# EAGLE design DA (EAGLE 9.4.2)
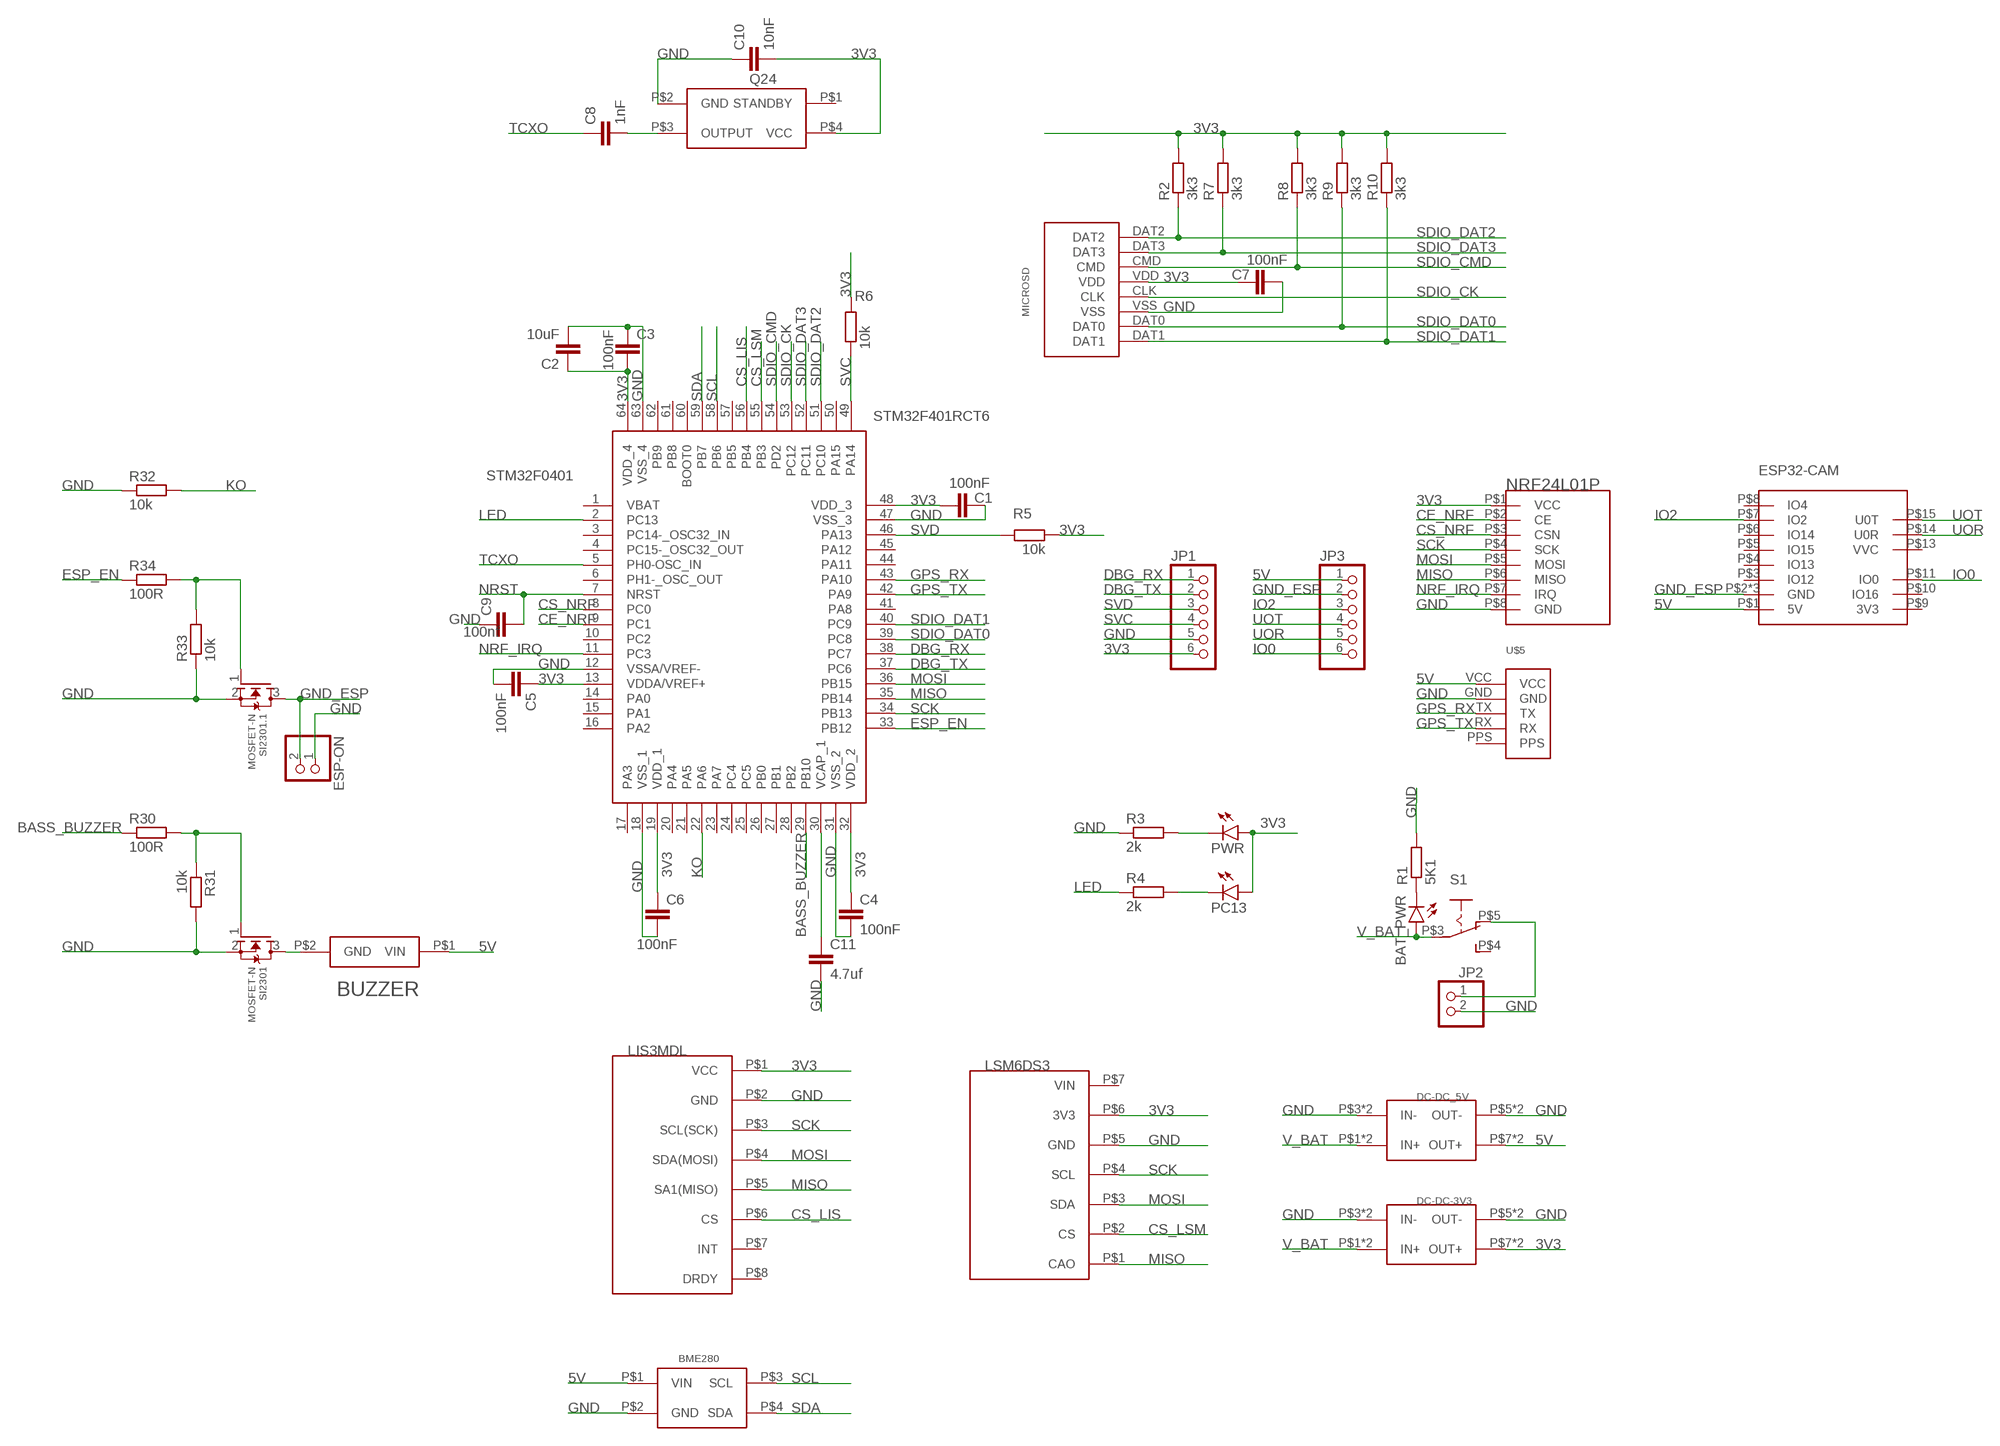
[diagram p0: schematic, sheet 1]

## Parts
BAT_PWR  LEDSML0603  [SML0603]
BME280  BME280BME280-PINS-ONLY  [BME280-PINS-ONLY]
BUZZER  BUZZERS8R6  [BUZZER-S8R12]
C1  100nF  C-EUC0603  [C0603]
C2  10uF  C-EUC1206  [C1206]
C3  100nF  C-EUC0603  [C0603]
C4  100nF  C-EUC0603  [C0603]
C5  100nF  C-EUC0603  [C0603]
C6  100nF  C-EUC0603  [C0603]
C7  100nF  C-EUC0603  [C0603]
C8  1nF  C-EUC0603  [C0603]
C9  100nf  C-EUC0603  [C0603]
C10  10nF  C-EUC0603  [C0603]
C11  4.7uf  C-EUC0603  [C0603]
DC-DC-3V3  MP1584-B  [MP1584-B]
DC-DC_5V  MP1584-B  [MP1584-B]
ESP32-CAM  ESP32-CAM  [ESP32-CAM]
ESP-ON  PINHD-1X2  [1X02]
JP1  PINHD-1X6  [1X06]
JP2  PINHD-1X2  [1X02]
JP3  PINHD-1X6  [1X06]
LIS3MDL  LIS3MDL-CJMCUбез_отв.  [LIS3MDL-CGMSU-NB2023-1]
LSM6DS3  LSM6DS3-GY-NB2023Без_отв.  [LSM6DS3-GY-NB2023-1]
MICROSD  SD  [SD]
NRF24L01P  NRF24L01_ML01SP4  [NRF24L01_ML01SP4]
PC13  LEDCHIPLED_0603  [CHIPLED_0603]
PWR  LEDCHIPLED_0603  [CHIPLED_0603]
Q24  Q24  [Q24]
R1  5K1  R-EU_R0603  [R0603]
R2  3k3  R-EU_R0603  [R0603]
R3  2k  R-EU_R0603  [R0603]
R4  2k  R-EU_R0603  [R0603]
R5  10k  R-EU_R0603  [R0603]
R6  10k  R-EU_R0603  [R0603]
R7  3k3  R-EU_R0603  [R0603]
R8  3k3  R-EU_R0603  [R0603]
R9  3k3  R-EU_R0603  [R0603]
R10  3k3  R-EU_R0603  [R0603]
R30  100R  R-EU_R0603  [R0603]
R31  10k  R-EU_R0603  [R0603]
R32  10k  R-EU_R0603  [R0603]
R33  10k  R-EU_R0603  [R0603]
R34  100R  R-EU_R0603  [R0603]
S1  UNICS-SWITCH  [SWITCH_SK-12F14]
SI2301  MOSFET-N  [SOT23-3]
SI2301.1  MOSFET-N  [SOT23-3]
STM32F0401  STM32F401RCT6  [QFP50P1200X1200X160-64N]
U$5  GPS_NEO7M_W-PPS  [GPS_NEO7M_W-PPS_&_ANT]

## Nets
3V3: C1.2 C2.1 C3.2 C4.1 C5.1 C6.1 C7.2 C10.2 DC-DC-3V3.P$7(OUT+) DC-DC-3V3.P$8(OUT+) JP1.6 LIS3MDL.P$1(VCC) LSM6DS3.P$6(3V3) MICROSD.VDD NRF24L01P.P$1(VCC) PC13.A PWR.A Q24.P$4(VCC) R2.2 R5.2 R6.2 R7.2 R8.2 R9.2 R10.2 STM32F0401.13(VDDA/VREF+) STM32F0401.19(VDD_1) STM32F0401.32(VDD_2) STM32F0401.48(VDD_3) STM32F0401.64(VDD_4)
5V: BME280.P$1(VIN) BUZZER.P$1(VIN) DC-DC_5V.P$7(OUT+) DC-DC_5V.P$8(OUT+) ESP32-CAM.P$1(5V) JP3.1 U$5.VCC
BASS_BUZZER: R30.1 STM32F0401.29(PB10)
CE_NRF: NRF24L01P.P$2(CE) STM32F0401.9(PC1)
CS_LIS: LIS3MDL.P$6(CS) STM32F0401.56(PB4)
CS_LSM: LSM6DS3.P$2(CS) STM32F0401.55(PB3)
CS_NRF: NRF24L01P.P$3(CSN) STM32F0401.8(PC0)
DBG_RX: JP1.1 STM32F0401.38(PC7)
DBG_TX: JP1.2 STM32F0401.37(PC6)
ESP_EN: R34.1 STM32F0401.33(PB12)
GND: BME280.P$2(GND) C1.1 C2.2 C3.1 C4.2 C5.2 C6.2 C7.1 C9.1 C10.1 C11.2 DC-DC-3V3.P$3(IN-) DC-DC-3V3.P$4(IN-) DC-DC-3V3.P$5(OUT-) DC-DC-3V3.P$6(OUT-) DC-DC_5V.P$3(IN-) DC-DC_5V.P$4(IN-) DC-DC_5V.P$5(OUT-) DC-DC_5V.P$6(OUT-) ESP-ON.1 JP1.5 JP2.2 LIS3MDL.P$2(GND) LSM6DS3.P$5(GND) MICROSD.VSS NRF24L01P.P$8(GND) Q24.P$2(GND) R1.2 R3.1 R31.2 R32.1 R33.1 SI2301.1.2(S) SI2301.2(S) STM32F0401.12(VSSA/VREF-) STM32F0401.18(VSS_1) STM32F0401.31(VSS_2) STM32F0401.47(VSS_3) STM32F0401.63(VSS_4) U$5.GND
GND_ESP: ESP32-CAM.P$2(GND) ESP32-CAM.P$12(GND) ESP32-CAM.P$16(GND) ESP-ON.2 JP3.2 SI2301.1.3(D)
GPS_RX: STM32F0401.43(PA10) U$5.TX
GPS_TX: STM32F0401.42(PA9) U$5.RX
IO0: ESP32-CAM.P$11(IO0) JP3.6
IO2: ESP32-CAM.P$7(IO2) JP3.3
KO: R32.2 STM32F0401.22(PA6)
LED: R4.1 STM32F0401.2(PC13)
MISO: LIS3MDL.P$5(SA1(MISO)) LSM6DS3.P$1(CAO) NRF24L01P.P$6(MISO) STM32F0401.35(PB14)
MOSI: LIS3MDL.P$4(SDA(MOSI)) LSM6DS3.P$3(SDA) NRF24L01P.P$5(MOSI) STM32F0401.36(PB15)
N$1: R30.2 R31.1 SI2301.1(G)
N$4: R33.2 R34.2 SI2301.1.1(G)
N$5: BAT_PWR.C R1.1
N$6: JP2.1 S1.P$5(O)
N$10: C8.2 Q24.P$3(OUTPUT)
N$12: C11.1 STM32F0401.30(VCAP_1)
N$20: BUZZER.P$2(GND) SI2301.3(D)
N$36: PWR.C R3.2
N$37: PC13.C R4.2
NRF_IRQ: NRF24L01P.P$7(IRQ) STM32F0401.11(PC3)
NRST: C9.2 STM32F0401.7(NRST)
SCK: LIS3MDL.P$3(SCL(SCK)) LSM6DS3.P$4(SCL) NRF24L01P.P$4(SCK) STM32F0401.34(PB13)
SCL: BME280.P$3(SCL) STM32F0401.58(PB6)
SDA: BME280.P$4(SDA) STM32F0401.59(PB7)
SDIO_CK: MICROSD.CLK STM32F0401.53(PC12)
SDIO_CMD: MICROSD.CMD R8.1 STM32F0401.54(PD2)
SDIO_DAT0: MICROSD.DAT0 R9.1 STM32F0401.39(PC8)
SDIO_DAT1: MICROSD.DAT1 R10.1 STM32F0401.40(PC9)
SDIO_DAT2: MICROSD.DAT2 R2.1 STM32F0401.51(PC10)
SDIO_DAT3: MICROSD.DAT3 R7.1 STM32F0401.52(PC11)
SVC: JP1.4 R6.1 STM32F0401.49(PA14)
SVD: JP1.3 R5.1 STM32F0401.46(PA13)
TCXO: C8.1 STM32F0401.5(PH0-OSC_IN)
UOR: ESP32-CAM.P$14(U0R) JP3.5
UOT: ESP32-CAM.P$15(U0T) JP3.4
V_BAT: BAT_PWR.A DC-DC-3V3.P$1(IN+) DC-DC-3V3.P$2(IN+) DC-DC_5V.P$1(IN+) DC-DC_5V.P$2(IN+) S1.P$3(P)
Unconnected: ESP32-CAM.P$3(IO12) ESP32-CAM.P$4(IO13) ESP32-CAM.P$5(IO15) ESP32-CAM.P$6(IO14) ESP32-CAM.P$8(IO4) ESP32-CAM.P$9(3V3) ESP32-CAM.P$10(IO16) ESP32-CAM.P$13(VVC) LIS3MDL.P$7(INT) LIS3MDL.P$8(DRDY) LSM6DS3.P$7(VIN) Q24.P$1(STANDBY) S1.P$4(S) STM32F0401.1(VBAT) STM32F0401.3(PC14-_OSC32_IN) STM32F0401.4(PC15-_OSC32_OUT) STM32F0401.6(PH1-_OSC_OUT) STM32F0401.10(PC2) STM32F0401.14(PA0) STM32F0401.15(PA1) STM32F0401.16(PA2) STM32F0401.17(PA3) STM32F0401.20(PA4) STM32F0401.21(PA5) STM32F0401.23(PA7) STM32F0401.24(PC4) STM32F0401.25(PC5) STM32F0401.26(PB0) STM32F0401.27(PB1) STM32F0401.28(PB2) STM32F0401.41(PA8) STM32F0401.44(PA11) STM32F0401.45(PA12) STM32F0401.50(PA15) STM32F0401.57(PB5) STM32F0401.60(BOOT0) STM32F0401.61(PB8) STM32F0401.62(PB9) U$5.PPS

## Library data of the parts
BAT_PWR PC13 PWR = led:LED: LED OSRAM: - CHIPLED LG R971, LG N971, LY N971, LG Q971, LY Q971, LO R971, LY R971 LH N974, LH R974 LS Q976, LO Q976, LY Q976 LO Q996 - Hyper CHIPLED LW Q18S LB Q993, LB Q99A, LB R99A - SideLED LS A670, LO A670, LY A670, LG A670, LP A670 LB A673, LV A673, LT A673, LW A673 LH A674 LY A675 LS A676, LA A676, LO A676, LY A676, LW A676 LS A679, LY A679, LG A679 - Hyper Micro SIDELED® LS Y876, LA Y876, LO Y876, LY Y876 LT Y87S - SmartLED LW L88C, LW L88S LB L89C, LB L89S, LG L890 LS L89K, LO L89K, LY L89K LS L896, LA L896, LO L896, LY L896 - TOPLED LS T670, LO T670, LY T670, LG T670, LP T670 LSG T670, LSP T670, LSY T670, LOP T670, LYG T670 LG T671, LOG T671, LSG T671 LB T673, LV T673, LT T673, LW T673 LH T674 LS T676, LA T676, LO T676, LY T676, LB T676, LH T676, LSB T676, LW T676 LB T67C, LV T67C, LT T67C, LS T67K, LO T67K, LY T67K, LW E67C LS E67B, LA E67B, LO E67B, LY E67B, LB E67C, LV E67C, LT E67C LW T67C LS T679, LY T679, LG T679 LS T770, LO T770, LY T770, LG T770, LP T770 LB T773, LV T773, LT T773, LW T773 LH T774 LS E675, LA E675, LY E675, LS T675 LS T776, LA T776, LO T776, LY T776, LB T776 LHGB T686 LT T68C, LB T68C - Hyper Mini TOPLED® LB M676 - Mini TOPLED Santana® LG M470 LS M47K, LO M47K, LY M47K Source: http://www.osram.convergy.de LUXEON: - LUMILED® LXK2-PW12-R00, LXK2-PW12-S00, LXK2-PW14-U00, LXK2-PW14-V00 LXK2-PM12-R00, LXK2-PM12-S00, LXK2-PM14-U00 LXK2-PE12-Q00, LXK2-PE12-R00, LXK2-PE12-S00, LXK2-PE14-T00, LXK2-PE14-U00 LXK2-PB12-K00, LXK2-PB12-L00, LXK2-PB12-M00, LXK2-PB14-N00, LXK2-PB14-P00, LXK2-PB14-Q00 LXK2-PR12-L00, LXK2-PR12-M00, LXK2-PR14-Q00, LXK2-PR14-R00 LXK2-PD12-Q00, LXK2-PD12-R00, LXK2-PD12-S00 LXK2-PH12-R00, LXK2-PH12-S00 LXK2-PL12-P00, LXK2-PL12-Q00, LXK2-PL12-R00 Source: www.luxeon.com KINGBRIGHT: KA-3528ASYC Source: www.kingbright.com
BME280 = NEON-BLADE-2023:BME280
BUZZER = NEON-BLADE-2023:BUZZER
C1-C11 = rcl:C-EU: CAPACITOR, European symbol; SPICEPREFIX: C
DC-DC-3V3 DC-DC_5V = NEON-BLADE-2023:MP1584-B
ESP32-CAM = NEON-BLADE-2023:ESP32-CAM
ESP-ON JP2 = pinhead:PINHD-1X2: PIN HEADER
JP1 JP3 = pinhead:PINHD-1X6: PIN HEADER
LIS3MDL = NEON-BLADE-2023:LIS3MDL-CJMCU
LSM6DS3 = NEON-BLADE-2023:LSM6DS3-GY-NB2023
MICROSD = NEON-BLADE-2023:SD
NRF24L01P = NEON-BLADE-2023:NRF24L01_ML01SP4
Q24 = CanCubeSat:Q24
R1-R10 R30-R34 = rcl:R-EU_: RESISTOR, European symbol; SPICEPREFIX: R
S1 = NEON-BLADE-2023:UNICS-SWITCH: SLIDING SWITCH Distributor Buerklin, 11G810
SI2301 SI2301.1 = NEON-BLADE-2023:MOSFET-N
STM32F0401 = STM32F401RCT6:STM32F401RCT6: 32-Bit MCU Cortex-M4 256KB 1.8V LQFP64 STMicroelectronics STM32F401RCT6, 32bit ARM Cortex M4 MCU, 84MHz, 256 kB Flash, 64-Pin LQFP Source: Datasheet <http://www.st.com/web/en/resource/technical/document/datasheet/DM00086815.pdf>; ARROW_PART_NUMBER: STM32F401RCT6; ARROW_PRICE-STOCK: https://www.arrow.com/en/products/stm32f401rct6/stmicroelectronics?region=nac; DESCRIPTION: 32-Bit MCU Cortex-M4 256KB 1.8V LQFP64 STMicroelectronics STM32F401RCT6, 32bit ARM Cortex M4 MCU, 84MHz, 256 kB Flash, 64-Pin LQFP; HEIGHT: 1.6mm; MANUFACTURER_NAME: STMicroelectronics; MANUFACTURER_PART_NUMBER: STM32F401RCT6; MOUSER_PART_NUMBER: 511-STM32F401RCT6; MOUSER_PRICE-STOCK: https://www.mouser.co.uk/ProductDetail/STMicroelectronics/STM32F401RCT6?qs=DqCdCwOw4%2F4JITyspz8omA%3D%3D
U$5 = NEON-BLADE-2023:GPS_NEO7M_W-PPS

## Board
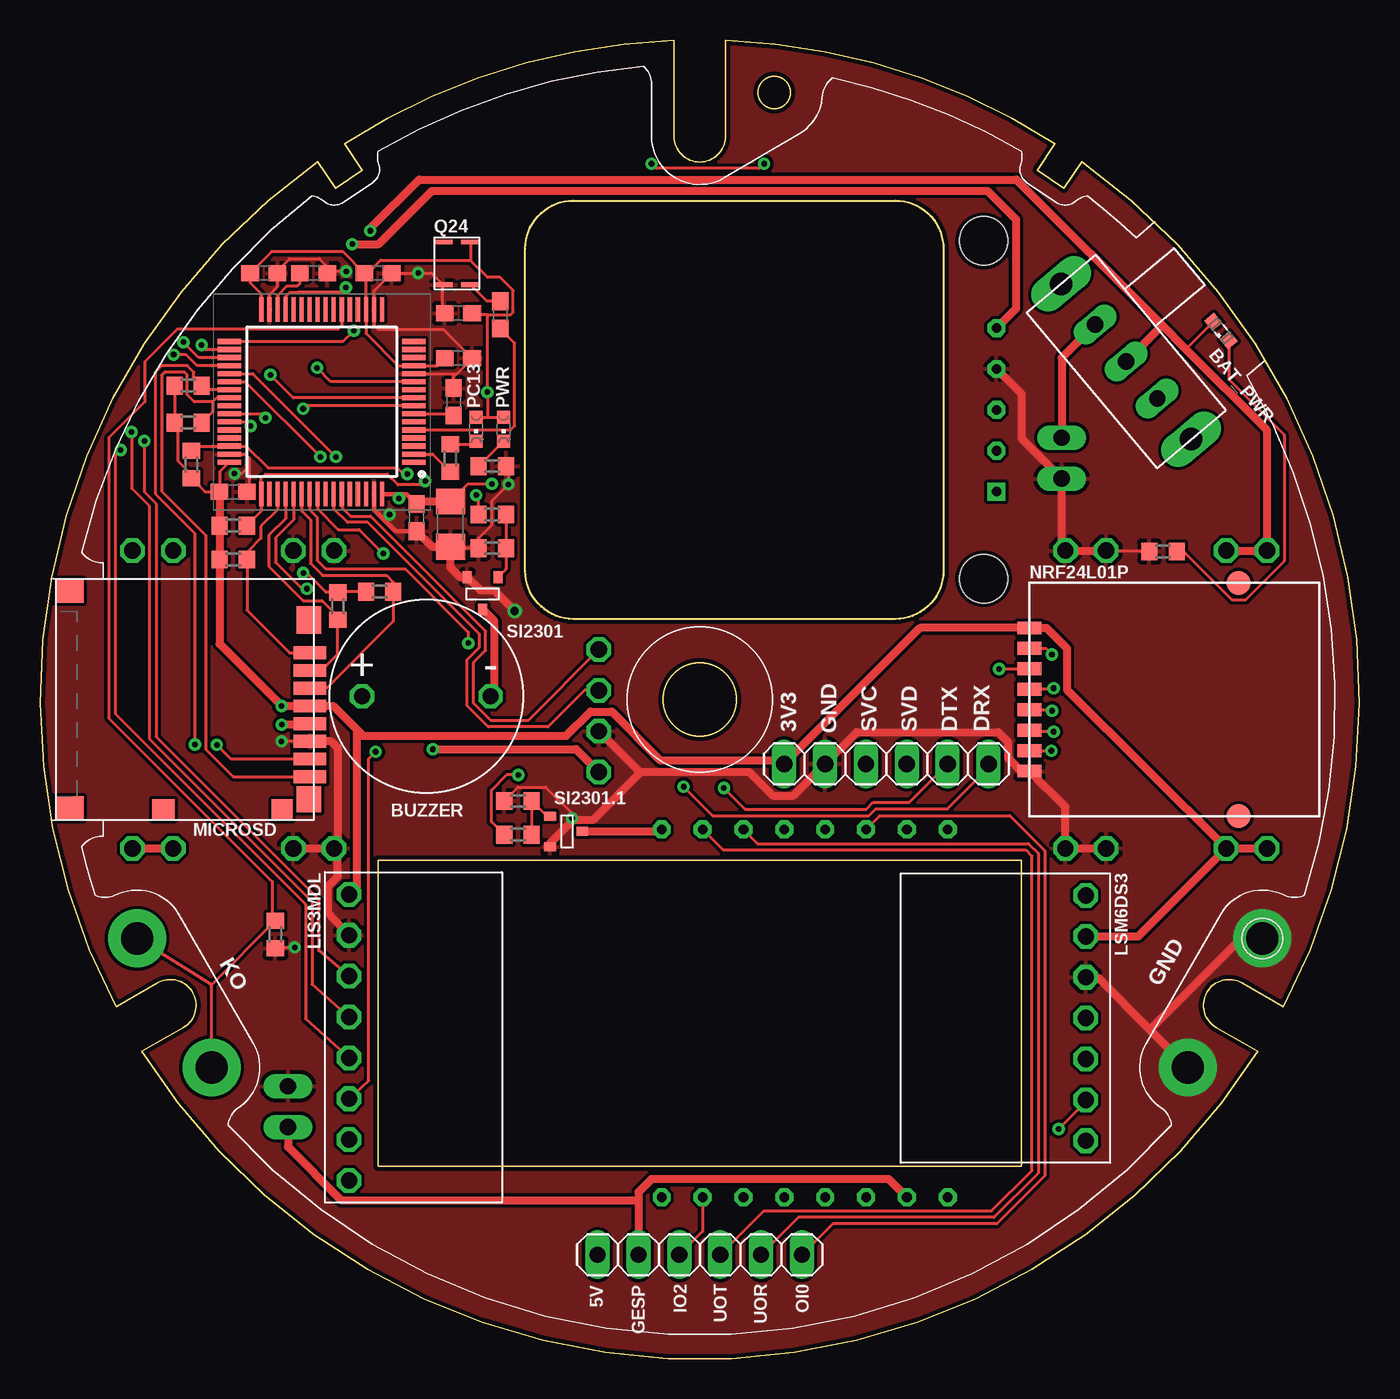
[diagram p1: board, top side]
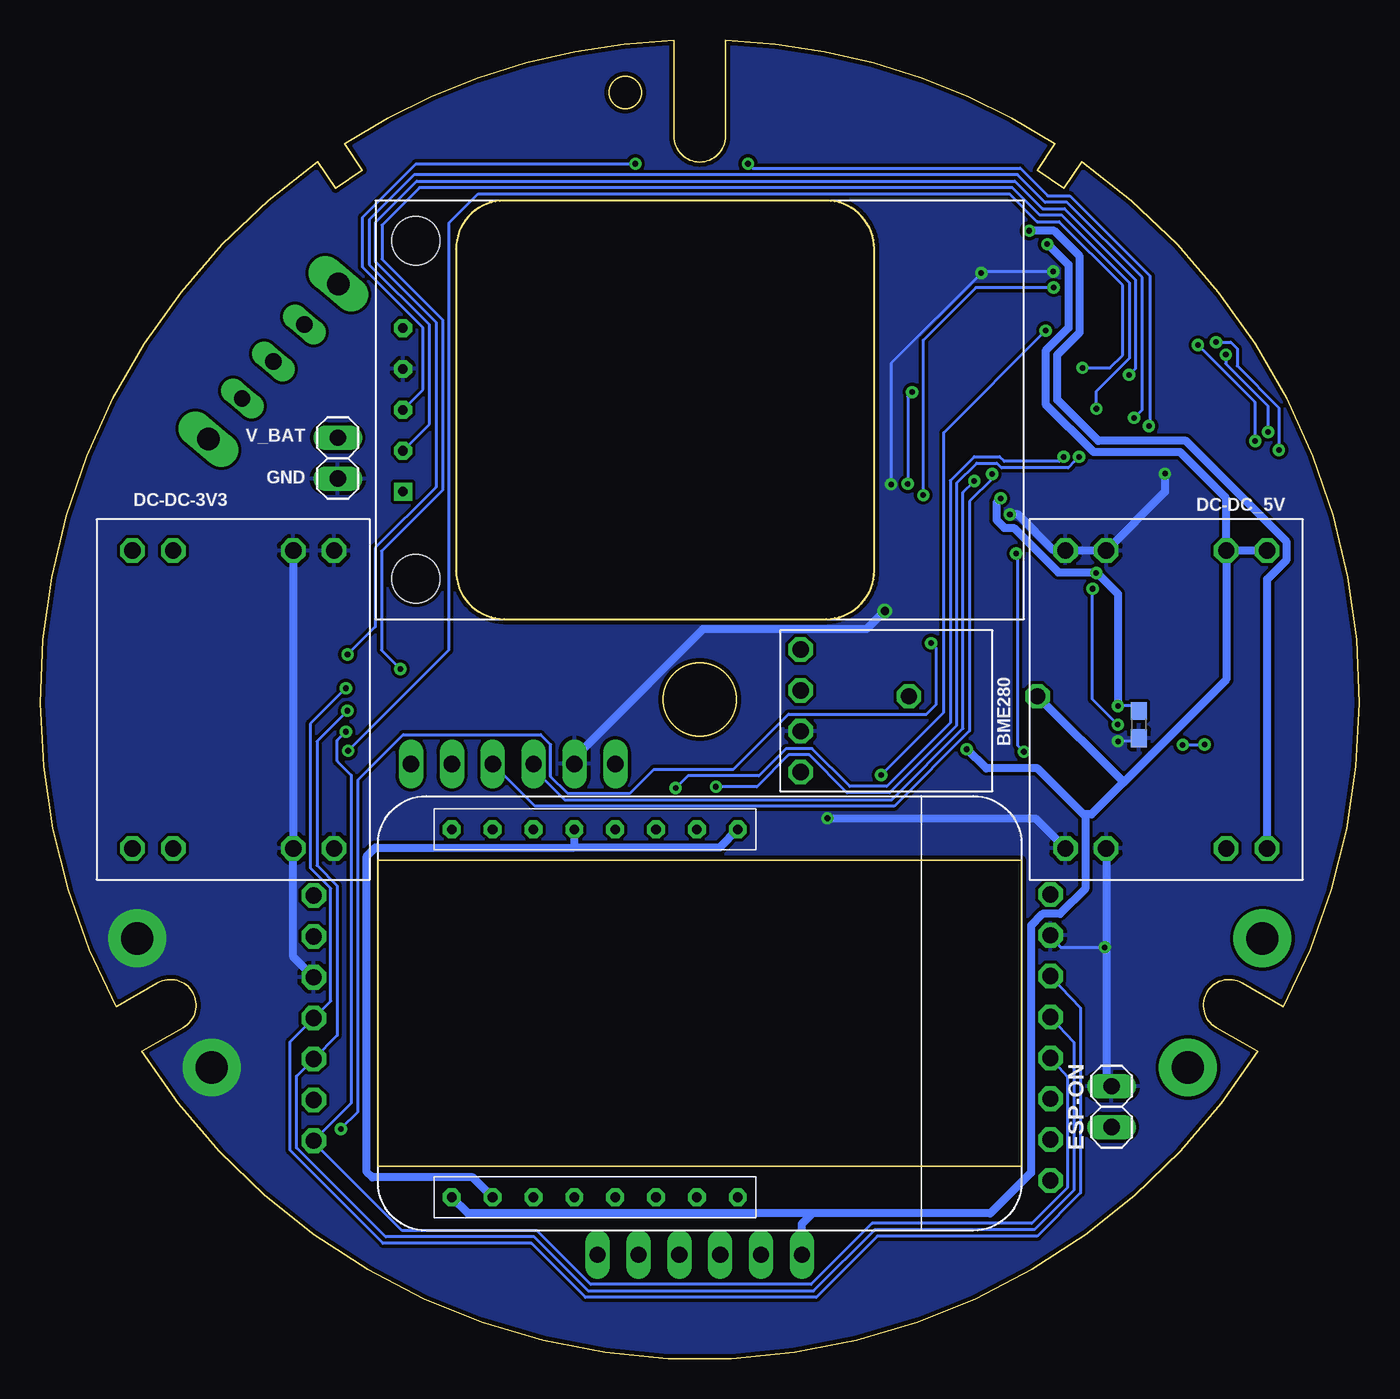
[diagram p2: board, bottom side, seen from below]

Size 82 x 81.92 mm. Coordinates in mm from the lower left corner, seen from the top.
Outline: 20.02,73.84 18.36,72.73 17.25,74.37 arc82 4.72,21.85 7.29,23.34 arc-180 8.89,20.57 6.32,19.08 arc116 75.68,19.08 73.11,20.57 arc-180 74.71,23.34 77.28,21.85 arc82 64.75,74.37 63.64,72.73 61.98,73.84 63.09,75.49 arc30 42.6,81.92 42.6,75.95 arc-180 39.4,75.95 39.4,81.92 arc30 18.91,75.49 20.02,73.84
Outline: 21,11.95 61,11.95 61,30.95 21,30.95 21,11.95
Outline: circle at 41,40.95 radius 2.25
Outline: circle at 45.63,78.67 radius 1
Copper layers (1*16): Top 0.035mm / dielectric 1.5mm / Bottom 0.035mm
Design rules "default *": minimum track width 0.2mm, minimum drill 0.35mm, track to track 0.2mm, track to pad 0.2mm, pad to pad 0.2mm, via to via 0.2mm, smd to smd 0.2mm, copper to edge 0.25mm, drill to drill 6mil, minimum pad ring 10mil, minimum via ring 8mil, stop-mask expansion 4mil, vias tented up to drill 0mil, thermal gap 10mil

### Footprints (pad centres in the part's own frame; a part is rotated, then mirrored left to right if it is on the bottom)
SML0603 = smd 0.8 x 0.8: A 0.75,0; C -0.75,0
BME280-PINS-ONLY = drill 1.016 octagon: P$1 -3.81,5.33; P$2 -1.27,5.33; P$3 1.27,5.33; P$4 3.81,5.33
BUZZER-S8R12 = drill 1 octagon: P$1 -4,0; P$2 4,0
C0603 = smd 1.1 x 1: 1 -0.85,0; 2 0.85,0
C1206 = smd 1.6 x 1.8: 1 -1.4,0; 2 1.4,0
MP1584-B = drill 1.016 octagon: P$1 1.95,2.23; P$2 1.95,4.77; P$3 1.95,12.23; P$4 1.95,14.77; P$5 20.45,14.77; P$6 20.45,12.23; P$7 20.45,4.77; P$8 20.45,2.23
ESP32-CAM = drill 0.6 octagon: P$1 -11.43,-15.42; P$2 -11.43,-12.88; P$3 -11.43,-10.34; P$4 -11.43,-7.8; P$5 -11.43,-5.26; P$6 -11.43,-2.72; P$7 -11.43,-0.18; P$8 -11.43,2.36; P$9 11.43,-15.42; P$10 11.43,-12.88; P$11 11.43,-10.34; P$12 11.43,-7.8; P$13 11.43,-5.26; P$14 11.43,-2.72; P$15 11.43,-0.18; P$16 11.43,2.36
1X02 = drill 1.016 long: 1 -1.27,0; 2 1.27,0
1X06 = drill 1.016 long: 1 -6.35,0; 2 -3.81,0; 3 -1.27,0; 4 1.27,0; 5 3.81,0; 6 6.35,0
LIS3MDL-CGMSU-NB2023-1 = drill 1.016 octagon: P$1 -8.89,-4; P$2 -6.35,-4; P$3 -3.81,-4; P$4 -1.27,-4; P$5 1.27,-4; P$6 3.81,-4; P$7 6.35,-4; P$8 8.89,-4
LSM6DS3-GY-NB2023-1 = drill 1.016 octagon: P$1 -7.62,-5; P$2 -5.08,-5; P$3 -2.54,-5; P$4 0,-5; P$5 2.54,-5; P$6 5.08,-5; P$7 7.62,-5
SD = smd 0.8 x 2: CLK 6,-15.77; CMD 8.2,-15.77; DAT0 3.8,-15.77; DAT1 2.7,-15.77; DAT2 10.4,-15.77; DAT3 9.3,-15.77; VDD 7.1,-15.77; VSS 4.9,-15.77 | smd 1.5 x 1.7: P$9 0.75,-0.85; P$13 14.25,-0.85 | smd 1.6 x 1.5: P$10 1.3,-15.7 | smd 1.29 x 1.3: P$11 0.645,-14.05 | smd 1.29 x 1.4: P$12 0.645,-6.65 | smd 1.7 x 1.5: P$14 12.45,-15.7
NRF24L01_ML01SP4 = smd 1.5 x 0.8: P$1 -9,4.445; P$2 -9,3.175; P$3 -9,1.905; P$4 -9,0.635; P$5 -9,-0.635; P$6 -9,-1.905; P$7 -9,-3.175; P$8 -9,-4.445 | smd 1.5 x 1.5: P$9 4,7.25; P$10 4,-7.25
CHIPLED_0603 = smd 0.8 x 0.8: A 0,-0.75; C 0,0.75
Q24 = smd 0.3 x 1.2: P$1 -1.325,-0.85; P$2 1.325,-0.85; P$3 1.325,0.85; P$4 -1.325,0.85
R0603 = smd 1 x 1.1: 1 -0.85,0; 2 0.85,0
SWITCH_SK-12F14 = drill 1.4 long: P$1 0.006,6.3; P$2 0.006,-6.3 | drill 1 long: P$3 0.006,0; P$4 0.006,-3; P$5 0.006,3
SOT23-3 = smd 0.56 x 0.73: 1 -0.95,-1; 2 0.95,-1; 3 0,1
QFP50P1200X1200X160-64N = smd 1.475 x 0.27: 1 -5.738,3.75; 2 -5.738,3.25; 3 -5.738,2.75; 4 -5.738,2.25; 5 -5.738,1.75; 6 -5.738,1.25; 7 -5.738,0.75; 8 -5.738,0.25; 9 -5.738,-0.25; 10 -5.738,-0.75; 11 -5.738,-1.25; 12 -5.738,-1.75; 13 -5.738,-2.25; 14 -5.738,-2.75; 15 -5.738,-3.25; 16 -5.738,-3.75; 33 5.738,-3.75; 34 5.738,-3.25; 35 5.738,-2.75; 36 5.738,-2.25; 37 5.738,-1.75; 38 5.738,-1.25; 39 5.738,-0.75; 40 5.738,-0.25; 41 5.738,0.25; 42 5.738,0.75; 43 5.738,1.25; 44 5.738,1.75; 45 5.738,2.25; 46 5.738,2.75; 47 5.738,3.25; 48 5.738,3.75 | smd 0.27 x 1.475: 17 -3.75,-5.738; 18 -3.25,-5.738; 19 -2.75,-5.738; 20 -2.25,-5.738; 21 -1.75,-5.738; 22 -1.25,-5.738; 23 -0.75,-5.738; 24 -0.25,-5.738; 25 0.25,-5.738; 26 0.75,-5.738; 27 1.25,-5.738; 28 1.75,-5.738; 29 2.25,-5.738; 30 2.75,-5.738; 31 3.25,-5.738; 32 3.75,-5.738; 49 3.75,5.738; 50 3.25,5.738; 51 2.75,5.738; 52 2.25,5.738; 53 1.75,5.738; 54 1.25,5.738; 55 0.75,5.738; 56 0.25,5.738; 57 -0.25,5.738; 58 -0.75,5.738; 59 -1.25,5.738; 60 -1.75,5.738; 61 -2.25,5.738; 62 -2.75,5.738; 63 -3.25,5.738; 64 -3.75,5.738
GPS_NEO7M_W-PPS_&_ANT = drill 0.6 octagon: GND -18.45,2.54; RX -18.45,-2.54; TX -18.45,0; VCC -18.45,5.08 | drill 0.6 square: PPS -18.45,-5.08 | hole 3: -17.65,10.5; -17.65,-10.5

### Placement (x,y rotation side)
BAT_PWR  73.4,63.85 130 top
BME280  29.4,40.25 90 bottom
BUZZER  24,41.15 0 top
C1  12,53.85 180 top
C2  25.5,51.85 270 top
C3  23.4,52.25 90 top
C4  13.9,67.45 0 top
C5  26,62.15 0 top
C6  21,67.45 0 top
C7  13.7,39.39 90 bottom
C8  28.6,64.85 90 top
C9  25.7,59.45 270 top
C10  26,64.95 0 top
C11  17,67.45 0 top
DC-DC-3V3  78.5,52.15 270 bottom
DC-DC_5V  3.5,29.75 90 bottom
ESP32-CAM  41,21.45 90 top
ESP-ON  15.4,15.65 270 bottom
JP1  52.6,36.95 180 top
JP2  63.5,55.95 270 bottom
JP3  41,6.45 0 top
LIS3MDL  23.2,19.95 270 top
LSM6DS3  60,21.15 90 top
MICROSD  1,33.45 90 top
NRF24L01P  70.5,40.95 0 top
PC13  27.1,57.75 180 top
PWR  28.8,57.75 180 top
Q24  25.9,68.05 270 top
R1  69.8,50.15 180 top
R2  12,49.65 180 top
R3  28.1,55.45 180 top
R4  25.5,55.95 90 top
R5  9.4,55.55 270 top
R6  12,51.75 180 top
R7  18.5,46.75 90 top
R8  21.1,47.65 180 top
R9  9.2,60.45 180 top
R10  9.2,58.15 180 top
R30  28.1,52.45 0 top
R31  28.1,50.35 180 top
R32  14.62,26.35 90 top
R33  29.7,34.65 0 top
R34  29.7,32.55 0 top
S1  67.5,61.95 40 top
SI2301  27.5,47.55 180 top
SI2301.1  32.7,32.75 270 top
STM32F0401  17.5,59.45 180 top
U$5  41,58.95 0 bottom

### Tracks (layer width: path | path; a pad name or v marks a point on that pad's centre or on a via)
3V3  (via drill 0.35)
  Top 0.2: C6.1 18.82,68.78 14.37,68.78 C4.1 13.05,66.85 13.75,66.15 STM32F0401.32 | C6.1 20.25,67.35 STM32F0401.19 20.25,63.7 22.25,61.7 STM32F0401.13 24.7,61.7 C5.1 | C6.1 20.38,67.45 21.18,68.25 26.72,68.25 26.75,68.23 | 27.8,64.85 29.22,64.85 29.4,65.03 29.4,66.38 28.6,67.18 27.8,67.18 26.75,68.23 | PC13.A 27.8,58.5 | 27.8,58.5 PWR.A | 27.8,58.5 v27.8,60.05 27.8,64.85 | R9.2 R10.2 8.55,57.95 8.55,55.78 9.4,54.93 R5.2 10.25,53.85 C1.2 11.15,55.09 STM32F0401.48 | Q24.P$4 26.75,68.23 | R8.2 18.55,47.65 R7.2 17.77,47.6 16.55,48.82 v16.35,48.82 | v28.07,54.35 28.05,54.33 26.58,54.33 C2.1 | 27.8,64.85 26.95,64.85 C10.2
  Top 0.28: STM32F0401.64 22.3,53.71 | 22.3,53.71 22.79,53.71 C3.2 | v22.3,53.45 22.3,53.71
  Top 0.5: DC-DC-3V3.P$7 DC-DC-3V3.P$8 | DC-DC-3V3.P$7 63.83,41.55 63.83,44.12 62.55,45.4 NRF24L01P.P$1 54.69,45.4 JP1.6 46.05,37.15 38.57,37.15 35.53,40.19 34.2,40.19 32.7,38.69 20.06,38.69 19.7,39.06 | LIS3MDL.P$1 19.7,29.24 19.7,39.06 | C1.2 R6.2 R2.2 11.15,44.4 v15,40.55 MICROSD.VDD 18.21,40.55 19.7,39.06 | C2.1 23.55,53.25 C3.2 | DC-DC-3V3.P$7 68.26,26.23 LSM6DS3.P$6
  Bottom 0.2: v28.07,54.35 28.07,59.78 v27.8,60.05 | C7.2 14.01,40.55 v15,40.55 | v16.35,48.82 16.4,48.86
  Bottom 0.5: v22.3,53.45 22.55,53.2 22.55,52.11 22.06,51.62 21.48,51.62 18.72,48.86 16.4,48.86 16.34,48.86 15,47.52 v15,40.55
5V  (via drill 0.35)
  Top 0.5: v19.4,69.25 21.04,69.25 24.35,72.57 58.88,72.57 60.66,70.78 60.66,65.25 U$5.VCC | v24.41,37.86 33.31,37.86 BME280.P$1
  Bottom 0.5: DC-DC_5V.P$8 DC-DC_5V.P$7 | v19.4,69.25 19.35,69.25 18.07,67.97 18.07,64.05 19.5,62.62 19.5,59.31 16.51,56.32 11.14,56.32 8.27,53.45 DC-DC_5V.P$7 | 14.65,35.8 BUZZER.P$1 | ESP32-CAM.P$1 55.42,9.02 34,9.02 | 34,9.02 22.93,9.02 20.41,11.54 20.41,26.9 19.69,27.63 18.6,27.63 17.04,29.19 17.04,33.71 17.14,33.81 | 17.14,33.81 20.01,36.67 23.19,36.67 24.38,37.86 v24.41,37.86 | 34,9.02 34.65,8.37 JP3.1 | 14.65,35.8 14.75,35.7 16.64,33.81 17.14,33.81 | DC-DC_5V.P$7 8.27,42.18 12.75,37.7 12.93,37.52 14.65,35.8
BASS_BUZZER  (via drill 0.35)
  Top 0.2: v19,66.55 18.7,66.25 16,66.25 15.52,66.25 15.25,65.98 STM32F0401.29 | R30.1 27.25,53.5 v27.1,53.65
  Bottom 0.2: v27.1,53.65 27.1,63.29 23.83,66.55 v19,66.55
CE_NRF  (via drill 0.35)
  Top 0.2: STM32F0401.9 15.73,59.7 v14.31,61.12 | NRF24L01P.P$2 62.52,44.13 v62.89,43.75
  Bottom 0.2: v14.31,61.12 13.9,61.53 13.9,67.02 18.33,71.45 19.7,71.45 21.41,73.17 58.59,73.17 61.15,70.6 61.15,68.15 57.4,64.4 57.4,54.15 61.18,50.37 61.18,45.47 v62.89,43.75
CS_LIS  (via drill 0.35)
  Top 0.2: STM32F0401.56 17.25,52.8 18.53,51.51 19.84,51.51 v21.33,50.02 | LIS3MDL.P$6 20.43,17.27 20.43,37.28 v20.85,37.7
  Bottom 0.2: v20.85,37.7 21.25,38.1 21.25,49.94 v21.33,50.02
CS_LSM  (via drill 0.35)
  Top 0.2: STM32F0401.55 16.75,52.73 17.2,52.28 17.2,49.62 17.75,49.07 22.68,49.07 26.61,45.15 v26.61,44.45 | v63.31,14.26 65,15.95 LSM6DS3.P$2
  Bottom 0.2: v63.31,14.26 62.27,15.31 62.27,35.94 59.43,38.78 50.89,38.78 50.27,38.15 50.27,36.17 49.23,35.13 45.32,35.13 43.84,36.61 38.91,36.61 35.47,40.04 26.91,40.04 26.33,40.62 26.33,44.17 v26.61,44.45
CS_NRF  (via drill 0.35)
  Top 0.2: STM32F0401.8 16.52,59.2 v16.35,59.02 | v59.61,42.85 NRF24L01P.P$3
  Bottom 0.2: v16.35,59.02 16.35,60.11 14.3,62.15 14.3,66.85 18.5,71.05 19.87,71.05 21.58,72.77 58.42,72.77 60.75,70.44 60.75,68.31 57,64.56 57,53.95 60.78,50.17 60.78,44.02 v59.61,42.85
DBG_RX  (via drill 0.35)
  Top 0.2: STM32F0401.38 12.75,60.7 v17.42,56.03 | JP1.1 58.95,36.7 56.4,34.15 51.94,34.15 51.53,33.74 41.79,33.74 v40,35.53
  Bottom 0.2: v17.42,56.03 17.7,55.75 18.1,55.35 22.24,55.35 22.54,55.65 23.77,55.65 25.03,54.39 25.03,39.33 29.2,35.16 31.84,35.16 34.19,37.5 35.47,37.5 37.44,35.53 v40,35.53
DBG_TX  (via drill 0.35)
  Top 0.2: STM32F0401.37 13.21,61.2 v18.38,56.03 | JP1.2 56.41,36.93 54.03,34.55 51.78,34.55 51.36,34.14 43.82,34.14 v42.5,35.45
  Bottom 0.2: v18.38,56.03 18.66,55.75 22.07,55.75 22.37,56.05 23.94,56.05 25.43,54.56 25.43,39.5 29.37,35.56 31.68,35.56 34.02,37.9 35.64,37.9 37.33,36.21 41.74,36.21 v42.5,35.45
ESP_EN  (via drill 0.35)
  Top 0.2: STM32F0401.33 18.83,63.2 v19.5,63.87 | R34.1 28.05,33.35 28.05,35.33 28.99,36.27 v29.72,36.27
  Bottom 0.2: v29.72,36.27 25.83,40.16 25.83,57.54 v19.5,63.87
GND  (via drill 0.35, 0.5, 2 pad 3.6)
  Top 0.2: v19.02,67.55 17.95,67.55 C11.2 17.85,67.85 17.35,68.35 15.5,68.35 14.75,67.6 C4.2 14.75,66.62 14.25,66.12 STM32F0401.31 | STM32F0401.12 25.9,61.2 | 25.9,61.2 C5.2 25.05,63.95 21,63.95 20.75,64.2 STM32F0401.18 20.75,66.35 C6.2 v23.5,67.45 24.32,67.45 Q24.P$2 25,66.68 25,65.1 C10.1 | C9.1 25.7,61 25.9,61.2 | STM32F0401.47 12.75,56.2 13,55.95 13,55.45 | 13,55.45 13,54 C1.1 | 18.5,31.98 18.48,31.97 | 13,55.45 12.54,54.99 v12.08,54.99 | R32.1 14.67,25.55 v15.82,25.55 | MICROSD.VSS v15,38.35 | R33.1 29.7,35.5 31.43,35.5 33.06,33.87 v33.06,33.57 33.15,33.48 | C2.2 25.6,50.35 R31.2 27.25,50.98 28.05,51.78 28.05,53.27 v29.11,54.32 29.11,55.29 R3.1 | DC-DC-3V3.P$3 68.9,50.2 R1.2
  Top 0.28: STM32F0401.63 20.75,52.76 21.38,52.13 | C3.1 22.11,51.4 21.38,52.13 | v21.72,52.45 21.4,52.13 21.38,52.13
  Top 0.5: DC-DC-3V3.P$6 DC-DC-3V3.P$5 63.73,34.28 NRF24L01P.P$8 60.98,36.51 60.16,37.33 60.16,38.32 59.55,38.93 50.76,38.93 JP1.5 46.82,34.98 45.55,34.98 44.07,36.45 37.35,36.45 | LSM6DS3.P$5 65.74,23.69 68.99,20.44 | v71.35,18.08 68.99,20.44 | DC-DC_5V.P$3 DC-DC_5V.P$4 18.48,31.97 | DC-DC-3V3.P$3 DC-DC-3V3.P$4 63.5,50.38 JP2.2 61,57.18 61,59.94 U$5.GND | MICROSD.VSS 18.1,38.35 18.5,37.95 18.5,31.98 18.5,29.95 17.9,29.35 17.9,27.71 LIS3MDL.P$2 | BME280.P$2 37.26,36.45 37.35,36.45 | 37.35,36.45 34.38,33.48 33.15,33.48 31.7,32.03 SI2301.1.2 | C3.1 24.35,50.45 C2.2 25.5,49.15 26.1,48.55 SI2301.2 27.36,47.74 28.21,47.74 v29.5,46.45 | 68.99,20.44 74.65,26.1 v75.98,26.1
  Bottom 0.2: v19.02,67.55 23.4,67.55 v23.5,67.45 29.11,61.84 v29.11,54.32 | C7.1 13.89,38.35 v15,38.35 | LIS3MDL.P$2 18.55,25.55 v15.82,25.55
  Bottom 0.5: DC-DC-3V3.P$3 DC-DC-3V3.P$6 66.27,24.96 LSM6DS3.P$5 | v29.5,46.45 30.63,45.32 40.8,45.32 48.79,37.34 JP1.5 | v21.72,52.45 21.22,52.45 18.97,50.2 DC-DC_5V.P$5 DC-DC_5V.P$6 12.08,53.85 v12.08,54.99 | DC-DC_5V.P$4 20.14,33.57 v33.06,33.57 | DC-DC_5V.P$3 15.73,17.25 ESP-ON.1
  pour Bottom: -0.7,82.55 -0.7,-0.65 82.7,-0.65 82.7,82.55
  pour Top: -0.4,82.15 82.3,82.15 82.3,-0.25 -0.4,-0.25
GND_ESP
  Top 0.5: SI2301.1.3 38.51,32.75 ESP32-CAM.P$16 | ESP32-CAM.P$2 52.75,11.15 38,11.15 37.19,10.34 37.19,9.85 | 37.19,9.85 JP3.2 | ESP-ON.2 15.4,13.15 18.7,9.85 37.19,9.85
  Bottom 0.5: ESP32-CAM.P$2 55.11,11.25 61.37,11.25 61.7,11.59 61.7,31.22 61.17,31.75 48.8,31.75 | ESP32-CAM.P$16 39.77,31.75 48.8,31.75 | ESP32-CAM.P$12 48.8,31.75
GPS_RX  (via drill 0.35)
  Top 0.2: STM32F0401.43 12.83,58.2 v13.08,57.95 | v45,74.24 44.71,73.95 38.29,73.95 v38,74.24
  Bottom 0.2: v13.08,57.95 13,58.03 13,67.25 18,72.25 19.37,72.25 21.08,73.97 37.72,73.97 v38,74.24 | U$5.TX 58.2,60.2 58.2,64.07 61.95,67.82 61.95,70.93 58.64,74.24 v45,74.24
GPS_TX  (via drill 0.35)
  Top 0.2: STM32F0401.42 13.75,58.7 v14,58.45
  Bottom 0.2: v14,58.45 13.5,58.95 13.5,67.19 18.17,71.85 19.53,71.85 21.25,73.57 58.75,73.57 61.55,70.77 61.55,67.98 57.8,64.23 57.8,58.06 U$5.RX
IO0
  Top 0.2: ESP32-CAM.P$11 52.19,33.74 60.27,33.74 62.45,31.55 62.45,11.35 59.47,8.37 49.27,8.37 JP3.6
IO2
  Top 0.2: ESP32-CAM.P$7 41.18,7.95 41.18,7.9 JP3.3
KO  (via drill 2 pad 3.6)
  Top 0.2: STM32F0401.22 18.75,64.2 18.5,63.95 8.5,63.95 6.5,61.95 6.5,59.45 4.27,57.22 4.27,39.79 14.42,29.64 14.42,27.4 R32.2 10.65,23.23 | v10.65,18.08 10.65,23.23 | 10.65,23.23 v6.02,26.1
LED
  Top 0.2: STM32F0401.2 24.4,56.2 R4.1
MISO  (via drill 0.35)
  Top 0.2: STM32F0401.35 9.86,62.2 v8.9,63.16 | LIS3MDL.P$5 16.5,21.12 16.5,28.22 4.67,40.05 4.67,56.12 v5,56.45 | v63,38.95 61.59,38.95 NRF24L01P.P$6
  Bottom 0.2: v8.9,63.16 8,63.16 7.6,62.76 7.6,61.68 5,59.08 v5,56.45 | LIS3MDL.P$5 18.14,17.51 18.14,10.62 20.36,8.4 30.29,8.4 34.09,4.6 47.78,4.6 51.13,7.95 59.5,7.95 65,13.45 LSM6DS3.P$1 62.67,15.86 62.67,36.25 63.53,37.12 63.53,38.42 v63,38.95
MOSI  (via drill 0.35)
  Top 0.2: STM32F0401.36 9.75,61.7 9.07,62.38 v8.3,62.38 | v5.68,57.58 5.68,54.08 6.8,52.96 6.8,38.49 16.9,28.39 16.9,23.24 LIS3MDL.P$4 | NRF24L01P.P$5 62.83,40.32 v62.9,40.25
  Bottom 0.2: v8.3,62.38 8.3,61.82 5.7,59.22 5.7,57.6 v5.68,57.58 | v62.9,40.25 64.8,38.35 64.8,30.64 63.54,29.38 63.54,20.07 LSM6DS3.P$3 66.06,17.55 66.06,13.09 60.52,7.55 51.29,7.55 47.94,4.2 33.92,4.2 30.12,8 20.19,8 17.74,10.46 17.74,19.65 LIS3MDL.P$4
N$1
  Top 0.2: R30.2 R31.1 28.95,49.05 SI2301.1
N$4
  Top 0.2: R34.2 R33.2 31.5,33.7 SI2301.1.1
N$5
  Top 0.2: R1.1 71.06,50.15 74.06,47.15 74.93,47.15 77.33,49.55 77.33,57.4 73.88,60.85 BAT_PWR.C
N$6
  Top 0.5: S1.P$5 63.5,62.18 JP2.1
N$10
  Top 0.2: C8.2 27.77,65.7 Q24.P$3
N$12
  Top 0.2: STM32F0401.30 14.75,66.05 15.35,66.65 16,66.65 16.15,66.8 C11.1
N$20
  Top 0.5: SI2301.3 28.24,45.82 28.24,41.39 BUZZER.P$2
N$36
  Top 0.2: PWR.C R3.2
N$37
  Top 0.2: R4.2 26.9,56.8 PC13.C
NRF_IRQ  (via drill 0.35)
  Top 0.2: STM32F0401.11 18.07,60.7 v17.21,61.56 | v62.86,37.77 62.84,37.78 NRF24L01P.P$7
  Bottom 0.2: v17.21,61.56 15.49,61.56 14.7,62.35 14.7,66.69 18.67,70.65 20.03,70.65 21.74,72.37 54.77,72.37 56.6,70.54 56.6,44.02 v62.86,37.77
NRST
  Top 0.2: STM32F0401.7 25.6,58.7 C9.2
SCK  (via drill 0.35)
  Top 0.2: STM32F0401.34 10.32,62.7 v10.03,62.99 | v6.47,57.02 6.47,53.85 7.2,53.12 7.2,38.65 17.3,28.55 17.3,25.36 LIS3MDL.P$3 | v63,41.65 62.93,41.59 NRF24L01P.P$4
  Bottom 0.2: v10.03,62.99 6.5,59.45 6.5,57.05 v6.47,57.02 | v63,41.65 65.21,39.44 65.21,30.48 63.94,29.21 63.94,22.21 LSM6DS3.P$4 66.46,19.69 66.46,12.93 60.69,7.15 51.46,7.15 48.11,3.8 33.75,3.8 29.95,7.6 20.03,7.6 17.34,10.29 17.34,21.79 LIS3MDL.P$3
SCL
  Top 0.2: STM32F0401.58 18.25,52.8 19.1,51.95 20.37,51.95 27.29,45.03 27.29,44.17 26.55,43.43 26.55,40.55 27.85,39.24 31.57,39.24 33.85,41.52 BME280.P$3
SDA
  Top 0.2: STM32F0401.59 18.75,52.9 19.3,52.35 20.53,52.35 27.69,45.2 27.69,44.01 26.95,43.26 26.95,40.72 28.02,39.64 30.31,39.64 BME280.P$4
SDIO_CK  (via drill 0.35)
  Top 0.2: STM32F0401.53 15.75,52.12 14.63,51 14.63,49.48 16.28,47.83 v16.58,47.83
  Top 0.5: MICROSD.CLK 16.71,39.39 v15.02,39.39
  Bottom 0.2: v15.02,39.39 16.58,40.95 v16.58,47.83
SDIO_CMD
  Top 0.2: STM32F0401.54 16.25,52.67 16.8,52.12 16.8,49.42 17.55,48.67 21.52,48.67 21.95,48.24 R8.1 21.95,45.8 17.8,41.65 MICROSD.CMD
SDIO_DAT0  (via drill 0.35)
  Top 0.2: STM32F0401.39 10.3,60.2 R9.1 9.55,60.95 9.55,61.29 9.14,61.7 7.56,61.7 7.15,61.29 7.15,53.74 9.62,51.27 v9.62,38.15 | MICROSD.DAT0 11.86,37.25 v10.98,38.13
  Bottom 0.2: v10.98,38.13 9.64,38.13 v9.62,38.15
SDIO_DAT1
  Top 0.2: R10.1 10.72,58.83 10.72,59.45 | 10.72,59.45 10.72,59.46 10.97,59.7 STM32F0401.40 | 10.72,59.45 9.58,59.45 9.15,59.88 9.15,61.13 8.97,61.3 7.73,61.3 7.55,61.13 7.55,53.9 10.3,51.15 10.3,37.85 12,36.15 MICROSD.DAT1
SDIO_DAT2
  Top 0.2: STM32F0401.51 14.75,52.75 13.71,51.71 13.71,50.96 12.85,50.1 R2.1 12.85,46.5 15.5,43.85 MICROSD.DAT2
SDIO_DAT3
  Top 0.2: MICROSD.DAT3 17.07,42.45 17.5,42.45 17.5,42.76 18.47,43.73 18.47,45.87 R7.1 18.5,46.13 17.52,47.1 16.35,47.1 14.21,49.24 14.21,51.14 15.25,52.19 STM32F0401.52
SVC  (via drill 0.35)
  Top 0.2: R6.1 13.75,52.65 STM32F0401.49 13.75,54.7 14,54.95 21.58,54.95 22.24,54.29 23.69,54.29 v23.93,54.53
  Bottom 0.2: v23.93,54.53 24.63,53.83 24.63,39.16 29.07,34.73 49.4,34.73 51.33,36.66 JP1.4
SVD  (via drill 0.35)
  Top 0.2: R5.1 9.7,56.7 STM32F0401.46 12.82,56.7 14.17,55.35 22.18,55.35 22.56,54.97 v22.82,54.97
  Bottom 0.2: v22.82,54.97 22.82,54.68 24.23,53.27 24.23,39 28.9,34.33 51.25,34.33 JP1.3
TCXO
  Top 0.2: STM32F0401.5 29.25,57.7 29.5,57.95 29.5,63.1 C8.1
UOR
  Top 0.2: ESP32-CAM.P$14 44.6,32 61.43,32 62.05,31.39 62.05,11.52 59.3,8.77 47.13,8.77 JP3.5
UOT
  Top 0.2: ESP32-CAM.P$15 42.46,31.6 61.27,31.6 61.65,31.22 61.65,11.68 59.13,9.17 44.99,9.17 JP3.4
V_BAT  (via drill 0.35)
  Top 0.2: BAT_PWR.A 71.22,62.73
  Top 0.5: DC-DC_5V.P$1 DC-DC_5V.P$2 | DC-DC-3V3.P$2 DC-DC-3V3.P$1 76.27,57.68 71.22,62.73 69.75,64.2 | v20.52,70.08 20.52,70.22 23.56,73.27 60.69,73.27 69.75,64.2 | S1.P$3 69.75,64.2
  Bottom 0.5: v20.52,70.08 18.96,70.08 17.37,68.5 17.37,63.76 18.77,62.36 18.77,59.57 16.22,57.02 10.78,57.02 4.52,50.75 4.52,49.65 5.73,48.44 DC-DC_5V.P$1

### Text on the board
bPlace: V_BAT | GND
tNames: 3V3 | GND | SVC | SVD | DTX | DRX | KO | GND | 5V | GESP | IO2 | UOT | UOR | OI0